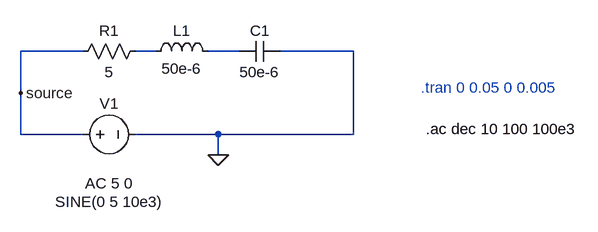
[diagram p0: schematic q1_schematic.asc]
q1_schematic.asc, the LTspice schematic file:
Version 4.1
SHEET 1 940 680
WIRE 160 112 64 112
WIRE 272 112 240 112
WIRE 400 112 352 112
WIRE 576 112 464 112
WIRE 64 176 64 112
WIRE 64 240 64 176
WIRE 160 240 64 240
WIRE 368 240 240 240
WIRE 576 240 576 112
WIRE 576 240 368 240
WIRE 368 272 368 240
FLAG 368 272 0
FLAG 64 176 source
SYMBOL res 144 128 R270
WINDOW 0 32 56 VTop 2
WINDOW 3 0 56 VBottom 2
SYMATTR InstName R1
SYMATTR Value 5
SYMBOL voltage 144 240 R270
WINDOW 0 32 56 VTop 2
WINDOW 3 -88 56 VBottom 2
WINDOW 123 -60 56 VBottom 2
WINDOW 39 0 0 Left 0
SYMATTR InstName V1
SYMATTR Value SINE(0 5 10e3)
SYMATTR Value2 AC 5 0
SYMBOL ind 256 128 R270
WINDOW 0 32 56 VTop 2
WINDOW 3 5 56 VBottom 2
SYMATTR InstName L1
SYMATTR Value 50e-6
SYMATTR SpiceLine Rser=0
SYMBOL cap 400 128 R270
WINDOW 0 32 32 VTop 2
WINDOW 3 0 32 VBottom 2
SYMATTR InstName C1
SYMATTR Value 50e-6
TEXT 688 232 Left 2 !.ac dec 10 100 100e3
TEXT 680 168 Left 2 ;.tran 0 0.05 0 0.005

The netlist it stands for:
* q1_schematic.asc
R1 source N001 5
V1 source 0 SINE(0 5 10e3) AC 5 0
L1 N001 N002 50e-6 Rser=0
C1 N002 0 50e-6
.ac dec 10 100 100e3
* .tran 0 0.05 0 0.005
.backanno
.end